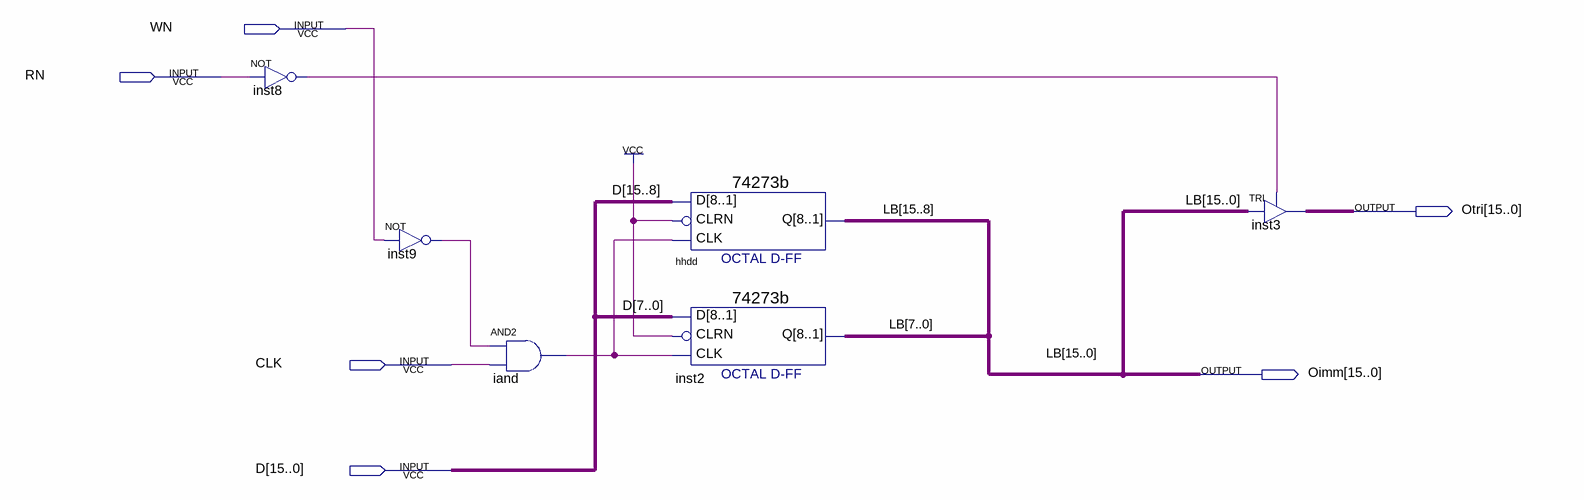
[diagram p0: schematic sheet]
// Quartus schematic REG16-TRI-IMM-BN.bdf as structural Verilog: 6 symbols, 6 pins
module \REG16-TRI-IMM-BN  (
  input  WN,
  input  RN,
  input  CLK,
  input  [15:0] D,
  output [15:0] Otri,
  output [15:0] Oimm
);

  wire iand_out, inst8_out, inst9_out;

  not inst8 (inst8_out, RN);
  not inst9 (inst9_out, WN);
  and iand (iand_out, inst9_out, CLK);
  \74273b  hhdd (.CLK(iand_out), .D(D[15:8]), .CLRN(1'b1), .Q(Oimm[15:8]));
  \74273b  inst2 (.CLK(iand_out), .D(D[7:0]), .CLRN(1'b1), .Q(Oimm[7:0]));
  TRI inst3[15:0] (.IN(Oimm), .OE(inst8_out), .OUT(Otri));

  // Other names for the same wires on the sheet: LB[15:0] = Oimm
endmodule
